# Altium project pca10056.PrjPCB (part 2 of 4)

## Sheet pca10056_sheet5_misc.SchDoc: PCA10056 - Miscellaneous
size A3; Organization: Nordic Semiconductor; DocumentNumber: 5; Revision: 2.0.1; SheetNumber: 5; SheetTotal: 7; Author: RUBR; CompanyName: Nordic Semiconductor; DrawnBy: RUBR; ProjectName: nRF52840-DK
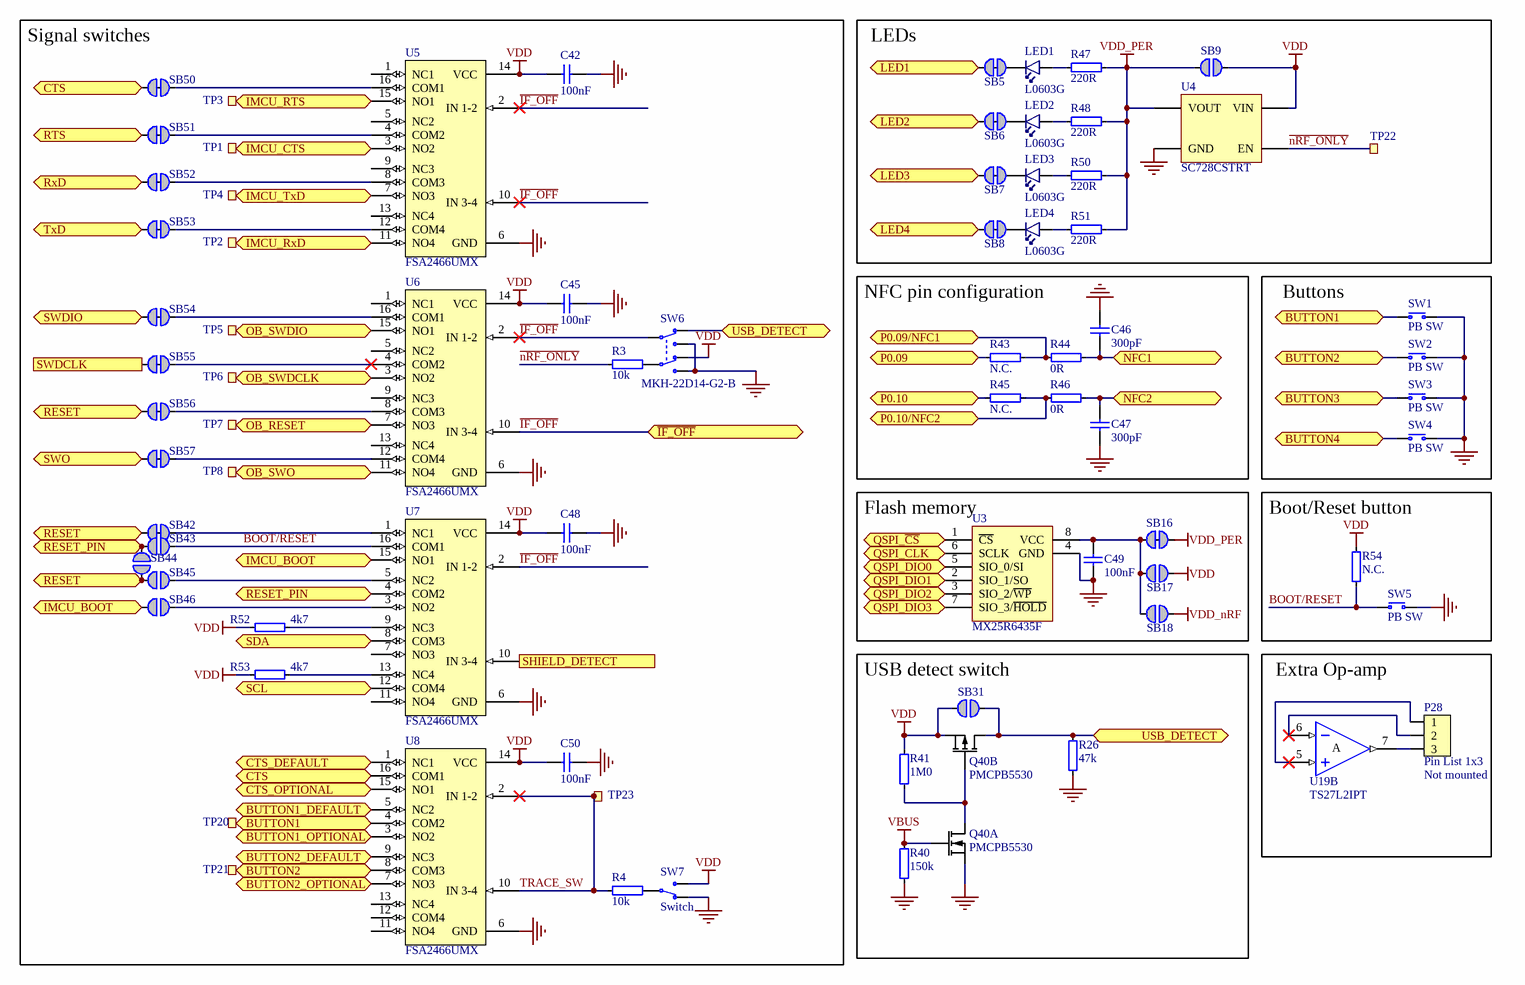
[diagram p4: pca10056_sheet5_misc.SchDoc]

### Parts
C42  100nF  [CAPC0603X03L_C]
C45  100nF  [CAPC0603X03L_C]
C46  300pF  [CAPC1005X04L]
C47  300pF  [CAPC1005X04L]
C48  100nF  [CAPC0603X03L_C]
C49  100nF  [CAPC0603X03L_C]
C50  100nF  [CAPC0603X03L_C]
LED1  L0603G  [LED_0603_G]
LED2  L0603G  [LED_0603_G]
LED3  L0603G  [LED_0603_G]
LED4  L0603G  [LED_0603_G]
P28  Pin List 1x3  Assembly: Not mounted  [LIST_1x3-NC]
Q40  PMCPB5530  [DFN65P200X200X80_HS-6N]  (parts A,B of 2)
R3  10k  [RESC0603X03L_C]
R4  10k  [RESC0603X03L_C]
R26  47k  [RESC0603X03L_C]
R40  150k  [RESC0603X03L_C]
R41  1M0  [RESC0603X03L_C]
R43  N.C.  [RESC1005X04L]
R44  0R  [RESC1005X04L]
R45  N.C.  [RESC1005X04L]
R46  0R  [RESC1005X04L]
R47  220R  [RESC0603X03L_C]
R48  220R  [RESC0603X03L_C]
R50  220R  [RESC0603X03L_C]
R51  220R  [RESC0603X03L_C]
R52  4k7  [RESC0603X03L_C]
R53  4k7  [RESC0603X03L_C]
R54  N.C.  [RESC0603X03L_C]
SB5  Solderbridge  [Solderbridge_Shorted]  (value not drawn)  (net tie, no BOM)
SB6  Solderbridge  [Solderbridge_Shorted]  (value not drawn)  (net tie, no BOM)
SB7  Solderbridge  [Solderbridge_Shorted]  (value not drawn)  (net tie, no BOM)
SB8  Solderbridge  [Solderbridge_Shorted]  (value not drawn)  (net tie, no BOM)
SB9  Solderbridge  [Solderbridge]  (value not drawn)  (no BOM)
SB16  Solderbridge  [Solderbridge_Shorted]  (value not drawn)  (net tie, no BOM)
SB17  Solderbridge  [Solderbridge]  (value not drawn)  (no BOM)
SB18  Solderbridge  [Solderbridge]  (value not drawn)  (no BOM)
SB31  Solderbridge  [Solderbridge]  (value not drawn)  (no BOM)
SB42  Solderbridge  [Solderbridge_Shorted]  (value not drawn)  (net tie, no BOM)
SB43  Solderbridge  [Solderbridge]  (value not drawn)  (no BOM)
SB44  Solderbridge  [Solderbridge]  (value not drawn)  (no BOM)
SB45  Solderbridge  [Solderbridge]  (value not drawn)  (no BOM)
SB46  Solderbridge  [Solderbridge]  (value not drawn)  (no BOM)
SB50  Solderbridge  [Solderbridge_Shorted]  (value not drawn)  (net tie, no BOM)
SB51  Solderbridge  [Solderbridge_Shorted]  (value not drawn)  (net tie, no BOM)
SB52  Solderbridge  [Solderbridge_Shorted]  (value not drawn)  (net tie, no BOM)
SB53  Solderbridge  [Solderbridge_Shorted]  (value not drawn)  (net tie, no BOM)
SB54  Solderbridge  [Solderbridge_Shorted]  (value not drawn)  (net tie, no BOM)
SB55  Solderbridge  [Solderbridge_Shorted]  (value not drawn)  (net tie, no BOM)
SB56  Solderbridge  [Solderbridge_Shorted]  (value not drawn)  (net tie, no BOM)
SB57  Solderbridge  [Solderbridge_Shorted]  (value not drawn)  (net tie, no BOM)
SW1  PB SW  [Switch-PB-6.2x6.3mm-SMD]
SW2  PB SW  [Switch-PB-6.2x6.3mm-SMD]
SW3  PB SW  [Switch-PB-6.2x6.3mm-SMD]
SW4  PB SW  [Switch-PB-6.2x6.3mm-SMD]
SW5  PB SW  [Switch-PB-6.2x6.3mm-SMD]
SW6  MKH-22D14-G2-B  [MKH-22D14-G2-B]
SW7  Switch  [CJS-120xA]
TP1  Ø1.0mm,SMD  [TP_SMD_Ø1.0mm]  (value not drawn)  (no BOM)
TP2  Ø1.0mm,SMD  [TP_SMD_Ø1.0mm]  (value not drawn)  (no BOM)
TP3  Ø1.0mm,SMD  [TP_SMD_Ø1.0mm]  (value not drawn)  (no BOM)
TP4  Ø1.0mm,SMD  [TP_SMD_Ø1.0mm]  (value not drawn)  (no BOM)
TP5  Ø1.0mm,SMD  [TP_SMD_Ø1.0mm]  (value not drawn)  (no BOM)
TP6  Ø1.0mm,SMD  [TP_SMD_Ø1.0mm]  (value not drawn)  (no BOM)
TP7  Ø1.0mm,SMD  [TP_SMD_Ø1.0mm]  (value not drawn)  (no BOM)
TP8  Ø1.0mm,SMD  [TP_SMD_Ø1.0mm]  (value not drawn)  (no BOM)
TP20  Ø1.0mm,SMD  [TP_SMD_Ø1.0mm]  (value not drawn)  (no BOM)
TP21  Ø1.0mm,SMD  [TP_SMD_Ø1.0mm]  (value not drawn)  (no BOM)
TP22  Ø1.0mm,SMD  [TP_SMD_Ø1.0mm]  (value not drawn)  (no BOM)
TP23  Ø1.0mm,SMD  [TP_SMD_Ø1.0mm]  (value not drawn)  (no BOM)
U3  MX25R6435F  [SON127P600X80_HS-9N]
U4  SC728CSTRT  [BGA4C40P2X2_76X76X62]
U5  FSA2466UMX  [XQFN40P180X260X50-16N]
U6  FSA2466UMX  [XQFN40P180X260X50-16N]
U7  FSA2466UMX  [XQFN40P180X260X50-16N]
U8  FSA2466UMX  [XQFN40P180X260X50-16N]
U19  TS27L2IPT  [TSOP65P640X120-8N]  (part B of 2)

### Blocks framed on the sheet
Signal switches: C42 C45 C48 C50 R3 R4 R52 R53 SB42-SB46 SB50-SB57 SW6 SW7 TP1-TP8 TP20 TP21 TP23 U5-U8
LEDs: LED1-LED4 R47 R48 R50 R51 SB5-SB9 TP22 U4
NFC pin configuration: C46 C47 R43-R46
Buttons: SW1-SW4
Flash memory: C49 SB16-SB18 U3
Boot/Reset button: R54 SW5
USB detect switch: Q40 R26 R40 R41 SB31
Extra Op-amp: P28 U19

### Ports
BUTTON1 (bidir), BUTTON1_DEFAULT (bidir), BUTTON1_OPTIONAL (bidir), BUTTON2 (bidir), BUTTON2_DEFAULT (bidir), BUTTON2_OPTIONAL (bidir), BUTTON3 (bidir), BUTTON4 (bidir), CTS (bidir), CTS_DEFAULT (bidir), CTS_OPTIONAL (bidir), IMCU_BOOT (bidir), IMCU_CTS (bidir), IMCU_RTS (bidir), IMCU_RxD (bidir), IMCU_TxD (bidir), LED1 (bidir), LED2 (bidir), LED3 (bidir), LED4 (bidir), NFC1 (bidir), NFC2 (bidir), OB_RESET (bidir), OB_SWDCLK (bidir), OB_SWDIO (bidir), OB_SWO (bidir), P0.09 (bidir), P0.09/NFC1 (bidir), P0.10 (bidir), P0.10/NFC2 (bidir), QSPI_CLK (bidir), QSPI_DIO0 (bidir), QSPI_DIO1 (bidir), QSPI_DIO2 (bidir), QSPI_DIO3 (bidir), QSPI_~{CS} (bidir), RESET (bidir), RESET_PIN (bidir), RTS (bidir), RxD (bidir), SCL (bidir), SDA (bidir), SHIELD_DETECT (in), SWDCLK (out), SWDIO (bidir), SWO (bidir), TxD (bidir), USB_DETECT (bidir), ~{IF_OFF} (bidir)

### Nets
GND: C42.1 C45.1 C46.2 C47.1 C48.1 C49.1 C50.1 Q40.1(S1) R26.2 R40.2 SW1.1(N.O) SW2.1(N.O) SW3.1(N.O) SW4.1(N.O) SW5.1(N.O) SW6.1(N.O-1) SW6.4(N.O-2) SW7.1(N.C) U3.4(GND) U3.9(GND) U4.B1(GND) U5.6(GND) U6.6(GND) U7.6(GND) U8.6(GND)
VBUS: Q40.2(G1) R40.1
VDD: C42.2 C45.2 C48.2 C50.2 Q40.4(S2) R41.1 R52.1 R53.1 R54.2 SB9.1 SB17.1 SB31.1 SW6.6(N.C-2) SW7.3(N.O) U4.A2(VIN) U5.14(VCC) U6.14(VCC) U7.14(VCC) U8.14(VCC)
VDD_nRF: SB18.1
VDD_PER: R47.2 R48.2 R50.2 R51.2 SB9.2 SB16.1 U4.A1(VOUT)
BOOT/RESET: R54.1 SB43.1 SW5.2(COM) U7.16(COM1)
BUTTON1: SW1.2(COM) TP20.1 U8.4(COM2) ; port BUTTON1
BUTTON2: SW2.2(COM) TP21.1 U8.8(COM3) ; port BUTTON2
CTS: SB50.1 U8.16(COM1) ; port CTS
D20: R43.1 ; port P0.09
D21: R45.1 ; port P0.10
~{IF_OFF}: SW6.2(COM-1) U5.2(IN_1-2) U5.10(IN_3-4) U6.2(IN_1-2) U6.10(IN_3-4) U7.2(IN_1-2) ; port ~{IF_OFF}
IMCU_BOOT: SB46.2 U7.15(NO1) ; port IMCU_BOOT
IMCU_CTS: TP1.1 U5.3(NO2) ; port IMCU_CTS
IMCU_RTS: TP3.1 U5.15(NO1) ; port IMCU_RTS
IMCU_RxD: TP2.1 U5.11(NO4) ; port IMCU_RxD
IMCU_TxD: TP4.1 U5.7(NO3) ; port IMCU_TxD
~{nRF_ONLY}: R3.1 TP22.1 U4.B2(EN)
NFC1: C46.1 R44.1 ; port NFC1
NFC2: C47.2 R46.1 ; port NFC2
OB_RESET: TP7.1 U6.7(NO3) ; port OB_RESET
OB_SWDCLK: TP6.1 U6.3(NO2) ; port OB_SWDCLK
OB_SWDIO: TP5.1 U6.15(NO1) ; port OB_SWDIO
OB_SWO: TP8.1 U6.11(NO4) ; port OB_SWO
P0.04/AIN2: U8.15(NO1) ; port CTS_OPTIONAL
P0.05/AIN3: SB51.1 ; port RTS
P0.06: SB53.1 ; port TxD
P0.07: U8.1(NC1) ; port CTS_DEFAULT
P0.08: SB52.1 ; port RxD
P0.09/NFC1: R43.2 R44.2 ; port P0.09/NFC1
P0.10/NFC2: R45.2 R46.2 ; port P0.10/NFC2
P0.11: U8.5(NC2) ; port BUTTON1_DEFAULT
P0.12: U8.9(NC3) ; port BUTTON2_DEFAULT
P0.13: SB5.1 ; port LED1
P0.14: SB6.1 ; port LED2
P0.15: SB7.1 ; port LED3
P0.16: SB8.1 ; port LED4
P0.18/RESET: SB42.2 SB44.2 SB45.2 SB56.1 ; port RESET
P0.24: SW3.2(COM) ; port BUTTON3
P0.25: SW4.2(COM) ; port BUTTON4
P1.00: SB57.1 ; port SWO
P1.07: U8.3(NO2) ; port BUTTON1_OPTIONAL
P1.08: U8.7(NO3) ; port BUTTON2_OPTIONAL
QSPI_~{CS}: U3.1(~{CS}) ; port QSPI_~{CS}
QSPI_CLK: U3.6(SCLK) ; port QSPI_CLK
QSPI_DIO0: U3.5(SIO_0/SI) ; port QSPI_DIO0
QSPI_DIO1: U3.2(SIO_1/SO) ; port QSPI_DIO1
QSPI_DIO2: U3.3(SIO_2/~{WP}) ; port QSPI_DIO2
QSPI_DIO3: U3.7(SIO_3/~{HOLD}) ; port QSPI_DIO3
RESET_PIN: SB43.2 SB44.1 U7.4(COM2) ; port RESET_PIN
SCL: U7.12(COM4) ; port SCL
SDA: U7.8(COM3) ; port SDA
SHIELD_DETECT: U7.10(IN_3-4) ; port SHIELD_DETECT
SWDCLK: SB55.1 ; port SWDCLK
SWDIO: SB54.1 ; port SWDIO
TRACE_SW: R4.1 TP23.1 U8.2(IN_1-2) U8.10(IN_3-4)
USB_DETECT: Q40.3(D2) R26.1 SB31.2 SW6.3(N.C-1) ; port USB_DETECT
NetC49_2: C49.2 SB16.2 SB17.2 SB18.2 U3.8(VCC)
NetLED1_1: LED1.1(C) SB5.2
NetLED1_2: LED1.2(A) R47.1
NetLED2_1: LED2.1(C) SB6.2
NetLED2_2: LED2.2(A) R48.1
NetLED3_1: LED3.1(C) SB7.2
NetLED3_2: LED3.2(A) R50.1
NetLED4_1: LED4.1(C) SB8.2
NetLED4_2: LED4.2(A) R51.1
NetP28_1: P28.1 U19.5(IN2+)
NetP28_2: P28.2 U19.6(IN2-)
NetP28_3: P28.3 U19.7(OUT2)
NetQ40_5: Q40.5(G2) Q40.6(D1) R41.2
NetR3_2: R3.2 SW6.5(COM-2)
NetR4_2: R4.2 SW7.2(COM)
NetR52_2: R52.2 U7.9(NC3)
NetR53_2: R53.2 U7.13(NC4)
NetSB42_1: SB42.1 U7.1(NC1)
NetSB45_1: SB45.1 U7.5(NC2)
NetSB46_1: SB46.1 U7.3(NO2)
NetSB50_2: SB50.2 U5.16(COM1)
NetSB51_2: SB51.2 U5.4(COM2)
NetSB52_2: SB52.2 U5.8(COM3)
NetSB53_2: SB53.2 U5.12(COM4)
NetSB54_2: SB54.2 U6.16(COM1)
NetSB55_2: SB55.2 U6.4(COM2)
NetSB56_2: SB56.2 U6.8(COM3)
NetSB57_2: SB57.2 U6.12(COM4)

Not connected (* = marked no-connect by the designer): U5 1(NC1) 5(NC2) 9(NC3) 13(NC4); U6 1(NC1) 5(NC2) 9(NC3) 13(NC4); U7 7(NO3) 11(NO4); U8 11(NO4) 12(COM4) 13(NC4)

### Notes on the sheet
- Size
- Date:
- A3
- Project Number
- Sheet         of
- Revision
- File:
- Drawn By:
- (in symbol TS27L2IPT, part B) A

### Library data of the parts
C42 C45 C48-C50 = C0201-100n: Capacitor, X5R, ±10%; Part number IPS: 00000001248; Note: 16V; Artikkelnr Noca: N.A.; Part Number: C0201-100n; Manufacturer: *; Manufacturer Part Number: *; Footprint Doc: 0201; LatestRevisionDate: 2017-11-09; Pin Count: 2; Publisher: Nordic Semiconductor; Published: 2014-11-13; Value: 100nF; ComponentLink1URL: *; ComponentLink1Description: Datasheet; ComponentLink2URL: *; ComponentLink2Description: Supplier link; HelpURL: *; Supplier 1: *; Supplier Part Number 1: *; Supplier 2: *; Supplier Part Number 2: *
C46 C47 = C0402-300p: Capacitor, NP0, ±5%; Part number IPS: N.A.; Note: 50V; Artikkelnr Noca: 20020004; Part Number: C0402-300p; Manufacturer: *; Manufacturer Part Number: *; Footprint Doc: 0402; LatestRevisionDate: 2016-08-25; Pin Count: 2; Publisher: Nordic Semiconductor; Published: 2015-05-29; Value: 300pF; ComponentLink1URL: *; ComponentLink1Description: Datasheet; ComponentLink2URL: *; ComponentLink2Description: Supplier link; HelpURL: *; Supplier 1: Digi-Key; Supplier Part Number 1: 490-3234-1-ND; Supplier 2: *; Supplier Part Number 2: *
LED1-LED4 = VS 25C7M5: LED, Green, 0603, 573nm, Vf=2.0V, 24mcd, - 40 to +85°C; Manufacturer: Victory Electronics; Part number IPS: N.A.; Artikkelnr Noca: 13019193; Part Number: VS 25C7M5; Manufacturer Part Number: VS 25C7M5; Footprint Doc: 0603; LatestRevisionDate: 2017-08-21; Pin Count: 2; Publisher: Nordic Semiconductor; Published: 2017-08-21; Value: L0603G; Note: *; ComponentLink1URL: *; ComponentLink1Description: Datasheet; ComponentLink2URL: *; ComponentLink2Description: Supplier link; HelpURL: \\hizz\pro\app9717\Datasheet\optoelectronics\Victory Electronics\VS 25C7M5.pdf; Supplier 1: EC Partner; Supplier Part Number 1: *; Supplier 2: *; Supplier Part Number 2: *
P28 = Pin List 1x3, N.C.: Pin List 1x3, 2.54mm (100mil); Artikkelnr Noca: N.A.; Part Number: Pin List 1x3, N.C.; Manufacturer: *; Manufacturer Part Number: *; Footprint Doc: LIST_1x3; LatestRevisionDate: 2017-09-07; Pin Count: 3; Publisher: Nordic Semiconductor; Published: 2017-09-07; Value: Pin List 1x3; Note: *; Part number IPS: N.A.; ComponentLink1URL: *; ComponentLink1Description: Datasheet; ComponentLink2URL: *; ComponentLink2Description: Supplier link; HelpURL: *; Supplier 1: *; Supplier Part Number 1: *; Supplier 2: *; Supplier Part Number 2: *
Q40 = PMCPB5530X,115: Mosfet Array N and P-Channel 20V 4A (Ta), 3.4A (Ta) 490mW Surface Mount 6-HUSON-EP (2x2); Manufacturer: Nexperia; Artikkelnr Noca: N.A.; Part Number: PMCPB5530X,115; Manufacturer Part Number: PMCPB5530X,115; LatestRevisionDate: 2018-04-30; Pin Count: 8; Publisher: Nordic Semiconductor; Published: 2018-04-30; Value: PMCPB5530; Note: *; Footprint Doc: 6-UDFN; Part number IPS: N.A.; ComponentLink1URL: https://assets.nexperia.com/documents/data-sheet/PMCPB5530X.pdf; ComponentLink1Description: Datasheet; ComponentLink2URL: https://www.digikey.com/product-detail/en/nexperia-usa-inc/PMCPB5530X115/1727-1327-1-ND/4386339; ComponentLink2Description: Supplier link; HelpURL: https://www.nexperia.com/products/mosfets/small-signal-mosfets/PMCPB5530X.html; Supplier 1: Digi-Key; Supplier Part Number 1: 1727-1327-1-ND; Supplier 2: Mouser; Supplier Part Number 2: 771-PMCPB5530X115
R3 R4 = R0201-10k: Resistor, ±1%, 0.05W; Part number IPS: 00000001255; Note: Chip Res 1%; Artikkelnr Noca: N.A.; Part Number: R0201-10k; Manufacturer: *; Manufacturer Part Number: *; Footprint Doc: 0201; LatestRevisionDate: 2014-11-13; Pin Count: 2; Publisher: Nordic Semiconductor; Published: 2014-11-13; Value: 10k; ComponentLink1URL: *; ComponentLink1Description: Datasheet; ComponentLink2URL: *; ComponentLink2Description: Supplier link; HelpURL: *; Supplier 1: *; Supplier Part Number 1: *; Supplier 2: *; Supplier Part Number 2: *
R26 = R0201-47k: Resistor, ±1%, 0.05W; Part number IPS: 00000001423; Note: Chip Res 1%; Artikkelnr Noca: N.A.; Part Number: R0201-47k; Manufacturer: *; Manufacturer Part Number: *; LatestRevisionDate: 2014-11-13; Pin Count: 2; Publisher: Nordic Semiconductor; Published: 2014-11-13; Value: 47k; Footprint Doc: 0201; ComponentLink1URL: *; ComponentLink1Description: Datasheet; ComponentLink2URL: *; ComponentLink2Description: Supplier link; HelpURL: *; Supplier 1: *; Supplier Part Number 1: *; Supplier 2: *; Supplier Part Number 2: *
R40 = R0201-150k: Resistor, ±1%, 0.05W; Part number IPS: 00000001422; Note: Chip Res 1%; Artikkelnr Noca: N.A.; Part Number: R0201-150k; Manufacturer: *; Manufacturer Part Number: *; LatestRevisionDate: 2014-11-13; Pin Count: 2; Publisher: Nordic Semiconductor; Published: 2014-11-13; Value: 150k; Footprint Doc: 0201; ComponentLink1URL: *; ComponentLink1Description: Datasheet; ComponentLink2URL: *; ComponentLink2Description: Supplier link; HelpURL: *; Supplier 1: *; Supplier Part Number 1: *; Supplier 2: *; Supplier Part Number 2: *
R41 = R0201-1M0: Resistor, ±1%, 0.05W; Part number IPS: 00000001418; Note: Chip Res 1%; Artikkelnr Noca: N.A.; Part Number: R0201-1M0; Manufacturer: *; Manufacturer Part Number: *; LatestRevisionDate: 2014-11-13; Pin Count: 2; Publisher: Nordic Semiconductor; Published: 2014-11-13; Value: 1M0; Footprint Doc: 0201; ComponentLink1URL: *; ComponentLink1Description: Datasheet; ComponentLink2URL: *; ComponentLink2Description: Supplier link; HelpURL: *; Supplier 1: *; Supplier Part Number 1: *; Supplier 2: *; Supplier Part Number 2: *
R43 R45 = R0402-N.C.: Not mounted; Note: Chip Res; Artikkelnr Noca: N.A.; Assembly: Not mounted; Part Number: R0402-N.C.; Manufacturer: *; Manufacturer Part Number: *; Footprint Doc: 0402; LatestRevisionDate: 2009-05-08; Pin Count: 2; Publisher: Nordic Semiconductor; Published: 2009-05-08; Value: N.C.; Part number IPS: N.A.; ComponentLink1URL: *; ComponentLink1Description: Datasheet; ComponentLink2URL: *; ComponentLink2Description: Supplier link; HelpURL: *; Supplier 1: *; Supplier Part Number 1: *; Supplier 2: *; Supplier Part Number 2: *
R44 R46 = R0402-0R: Resistor, ±5%, 0.063W; Part number IPS: 00000007128; Note: Chip Res 5%; Artikkelnr Noca: 27049000; Part Number: R0402-0R; Manufacturer: *; Manufacturer Part Number: *; Footprint Doc: 0402; LatestRevisionDate: 2009-11-23; Pin Count: 2; Publisher: Nordic Semiconductor; Published: 2009-05-08; Value: 0R; ComponentLink1URL: *; ComponentLink1Description: Datasheet; ComponentLink2URL: *; ComponentLink2Description: Supplier link; HelpURL: *; Supplier 1: Farnell; Supplier Part Number 1: 146-9661; Supplier 2: *; Supplier Part Number 2: *
R47 R48 R50 R51 = R0201-220: Resistor, ±1%, 0.05W; Part number IPS: 00000000863; Note: Chip Res 1%; Artikkelnr Noca: N.A.; Part Number: R0201-220; Manufacturer: *; Manufacturer Part Number: *; LatestRevisionDate: 2014-11-13; Pin Count: 2; Publisher: Nordic Semiconductor; Published: 2014-11-13; Value: 220R; Footprint Doc: 0201; ComponentLink1URL: *; ComponentLink1Description: Datasheet; ComponentLink2URL: *; ComponentLink2Description: Supplier link; HelpURL: *; Supplier 1: *; Supplier Part Number 1: *; Supplier 2: *; Supplier Part Number 2: *
R52 R53 = R0201-4k7: Resistor, ±1%, 0.05W; Part number IPS: 00000001706; Note: Chip Res 1%; Artikkelnr Noca: N.A.; Part Number: R0201-4k7; Manufacturer: *; Manufacturer Part Number: *; Footprint Doc: 0201; LatestRevisionDate: 2014-11-13; Pin Count: 2; Publisher: Nordic Semiconductor; Published: 2014-11-13; Value: 4k7; ComponentLink1URL: *; ComponentLink1Description: Datasheet; ComponentLink2URL: *; ComponentLink2Description: Supplier link; HelpURL: *; Supplier 1: *; Supplier Part Number 1: *; Supplier 2: *; Supplier Part Number 2: *
R54 = R0201-N.C.: Not mounted; Note: Chip Res; Artikkelnr Noca: N.A.; Assembly: Not mounted; Part Number: R0201-N.C.; Manufacturer: *; Manufacturer Part Number: *; Footprint Doc: 0201; LatestRevisionDate: 2014-11-13; Pin Count: 2; Publisher: Nordic Semiconductor; Published: 2014-11-13; Value: N.C.; Part number IPS: N.A.; ComponentLink1URL: *; ComponentLink1Description: Datasheet; ComponentLink2URL: *; ComponentLink2Description: Supplier link; HelpURL: *; Supplier 1: *; Supplier Part Number 1: *; Supplier 2: *; Supplier Part Number 2: *
SB5-SB8 SB16 SB42 SB50-SB57 = Solderbridge Shorted: Shorted Solderbridge; Artikkelnr Noca: N.A.; Part Number: Solderbridge Shorted; Manufacturer: *; Manufacturer Part Number: *; LatestRevisionDate: 2012-08-07; Pin Count: 2; Publisher: Nordic Semiconductor; Published: 2012-08-07; Value: Solderbridge; Note: *; Footprint Doc: Solderbridge_Shorted; Part number IPS: N.A.; ComponentLink1URL: *; ComponentLink1Description: Datasheet; ComponentLink2URL: *; ComponentLink2Description: Supplier link; HelpURL: *; Supplier 1: *; Supplier Part Number 1: *; Supplier 2: *; Supplier Part Number 2: *
SB9 SB17 SB18 SB31 SB43-SB46 = Solderbridge: Artikkelnr Noca: N.A.; Part Number: Solderbridge; Manufacturer: *; Manufacturer Part Number: *; LatestRevisionDate: 2009-12-14; Pin Count: 2; Publisher: Nordic Semiconductor; Published: 2009-12-14; Value: Solderbridge; Note: *; Footprint Doc: Solderbridge; Part number IPS: N.A.; ComponentLink1URL: *; ComponentLink1Description: Datasheet; ComponentLink2URL: *; ComponentLink2Description: Supplier link; HelpURL: *; Supplier 1: *; Supplier Part Number 1: *; Supplier 2: *; Supplier Part Number 2: *
SW1-SW5 = Switch-PB-6.2x6.3mm-SMD: Tactile Switch, SPNO, SMD, 160gf, 6.2x6.3x2.5mm; Manufacturer: Dailywell; Manufacturer Part Number: TS604VM1-025BR-R; Part number IPS: 00000007812; Artikkelnr Noca: 50019106; Part Number: Switch-PB-6.2x6.3mm-SMD; Footprint Doc: Switch-PB-6.2x6.3mm-SMD; LatestRevisionDate: 2016-04-21; Pin Count: 4; Publisher: Nordic Semiconductor; Published: 2010-02-01; Value: PB SW; Note: *; ComponentLink1URL: *; ComponentLink1Description: Datasheet; ComponentLink2URL: *; ComponentLink2Description: Supplier link; HelpURL: \\hizz\pro\app9717\Datasheet\switches\Dailywell\TS604VM1-025BR-R.pdf; Supplier 1: Cabcon; Supplier Part Number 1: TS604VM1-025BR-R; Supplier 2: Mouser; Supplier Part Number 2: 688-SKHUALE010
SW6 = MKH-22D14-G2-B: Slide Switch DPDT; Manufacturer: Dailywell; Part number IPS: N.A.; Artikkelnr Noca: 50019112; Part Number: MKH-22D14-G2-B; Manufacturer Part Number: MKH-22D14-G2-B; Footprint Doc: MKH-22D14-G2-B; LatestRevisionDate: 2016-08-18; Pin Count: 6; Publisher: Nordic Semiconductor; Published: 2016-08-18; Value: MKH-22D14-G2-B; Note: *; ComponentLink1URL: *; ComponentLink1Description: Datasheet; ComponentLink2URL: *; ComponentLink2Description: Supplier link; HelpURL: \\hizz\pro\app9717\Datasheet\switches\Dailywell\MKH-22D14-G2-B.pdf; Supplier 1: *; Supplier Part Number 1: *; Supplier 2: *; Supplier Part Number 2: *
SW7 = CJS-1200TA: SMD slide Switch (ON-ON); Manufacturer: Copal Electronics Inc; Part number IPS: 00000009982; Artikkelnr Noca: 50019068; Part Number: CJS-1200TA; Manufacturer Part Number: CJS-1200TA; Footprint Doc: CJS-120xA; LatestRevisionDate: 2012-10-03; Pin Count: 3; Publisher: Nordic Semiconductor; Published: 2012-10-03; Value: Switch; Note: *; ComponentLink1URL: *; ComponentLink1Description: Datasheet; ComponentLink2URL: *; ComponentLink2Description: Supplier link; HelpURL: http://media.digikey.com/pdf/Data%20Sheets/COPAL%20Electronics%20PDFs/CJS.pdf; Supplier 1: Digi-Key; Supplier Part Number 1: 563-1021-2-ND; Supplier 2: *; Supplier Part Number 2: *
TP1-TP8 TP20-TP23 = TP_SMD_Ø1.0MM: 1.0mm circular SMD testpad; Manufacturer: Nordic Semiconductor; Artikkelnr Noca: N.A.; Part Number: TP_SMD_Ø1.0MM; Manufacturer Part Number: *; LatestRevisionDate: 2013-06-11; Pin Count: 1; Publisher: Nordic Semiconductor; Published: 2013-06-11; Value: Ø1.0mm,SMD; Note: *; Footprint Doc: TP_SMD_Ø1.0mm; Part number IPS: N.A.; ComponentLink1URL: *; ComponentLink1Description: Datasheet; ComponentLink2URL: *; ComponentLink2Description: Supplier link; HelpURL: *; Supplier 1: *; Supplier Part Number 1: *; Supplier 2: *; Supplier Part Number 2: *
U3 = MX25R6435FZNIL0: Ultra low power, 64M-bit, serial multi I/O flash memory; Manufacturer: Macronix; Part number IPS: N.A.; Artikkelnr Noca: 15020015; Part Number: MX25R6435FZNIL0; Manufacturer Part Number: MX25R6435FZNIL0; Footprint Doc: WSON-8; LatestRevisionDate: 2016-06-29; Pin Count: 8; Publisher: Nordic Semiconductor; Published: 2016-06-29; Value: MX25R6435F; Note: *; ComponentLink1URL: *; ComponentLink1Description: Datasheet; ComponentLink2URL: *; ComponentLink2Description: Supplier link; HelpURL: http://www.macronix.com/Lists/Datasheet/Attachments/3881/MX25R6435F,%20Wide%20Range,%2064Mb,%20v1.3.pdf; Supplier 1: Future; Supplier Part Number 1: MX25R6435FZNIL0; Supplier 2: Arrow; Supplier Part Number 2: MX25R6435FZNIL0
U4 = SC728CSTRT: Semtech, 2A Low Vin, Very Low Ron, Load Switch, 4DSBGA; Manufacturer: Semtech Corporation; Part number IPS: N.A.; Artikkelnr Noca: 15070081; Part Number: SC728CSTRT; Manufacturer Part Number: SC728CSTRT; Footprint Doc: WCSP-4; LatestRevisionDate: 2015-01-01; Pin Count: 4; Publisher: Nordic Semiconductor; Published: 2016-06-16; Value: SC728CSTRT; Note: *; ComponentLink1URL: *; ComponentLink1Description: Datasheet; ComponentLink2URL: *; ComponentLink2Description: Supplier link; HelpURL: http://www.semtech.com/images/datasheet/sc728.pdf; Supplier 1: Digi-Key; Supplier Part Number 1: SC728CSTRTCT-ND; Supplier 2: Mouser; Supplier Part Number 2: 947-SC728CSTRT
U5-U8 = FSA2466UMX: Data / Audio Low-Voltage Dual DPDT Analog Switch; Manufacturer: ON Semiconductor; Part number IPS: 00000009986; Artikkelnr Noca: 15070069; Part Number: FSA2466UMX; Manufacturer Part Number: FSA2466UMX; Footprint Doc: UFQFN-16; LatestRevisionDate: 2019-05-15; Pin Count: 16; Publisher: Nordic Semiconductor; Published: 2016-05-18; Value: FSA2466UMX; Note: *; ComponentLink1URL: *; ComponentLink1Description: Datasheet; ComponentLink2URL: *; ComponentLink2Description: Supplier link; HelpURL: https://www.onsemi.com/pub/Collateral/FSA2466-D.PDF; Supplier 1: Digi-Key; Supplier Part Number 1: FSA2466UMXCT-ND; Supplier 2: Mouser; Supplier Part Number 2: 512-FSA2466UMX
U19 = TS27L2IPT: Precision very low power CMOS dual operational amplifier; Manufacturer: STMicroelectronics; Part number IPS: 00000009991; Artikkelnr Noca: 17010019; Part Number: TS27L2IPT; Manufacturer Part Number: TS27L2IPT; Footprint Doc: TSSOP-8; LatestRevisionDate: 2016-07-07; Pin Count: 8; Publisher: Nordic Semiconductor; Published: 2016-07-07; Value: TS27L2IPT; Note: *; ComponentLink1URL: *; ComponentLink1Description: Datasheet; ComponentLink2URL: *; ComponentLink2Description: Supplier link; HelpURL: http://www.st.com/content/ccc/resource/technical/document/datasheet/38/5b/ca/bd/c0/26/4a/34/CD00000880.pdf/files/CD00000880.pdf/jcr:content/translations/en.CD00000880.pdf; Supplier 1: Digi-Key; Supplier Part Number 1: 497-8085-1-ND; Supplier 2: *; Supplier Part Number 2: *